# EasyEDA Pro project ProPrj_IoT House_2026-04-28.epro, board PCB2
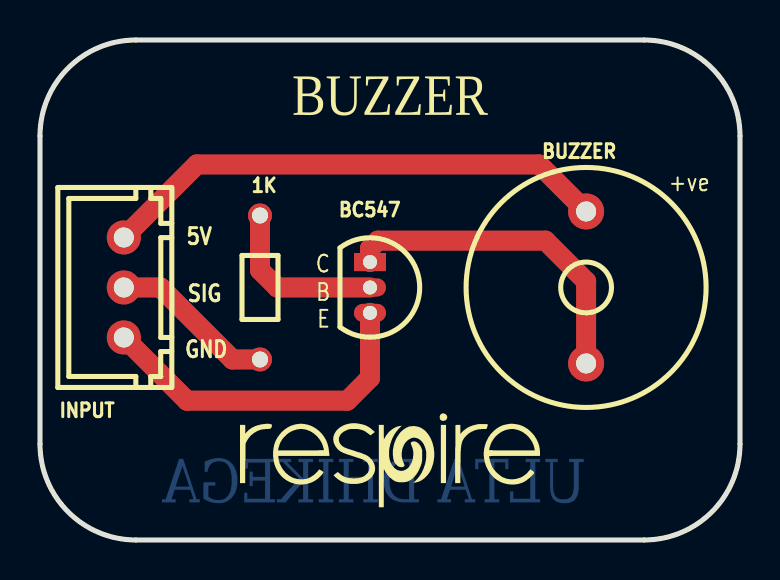
[diagram p7: board, top side]
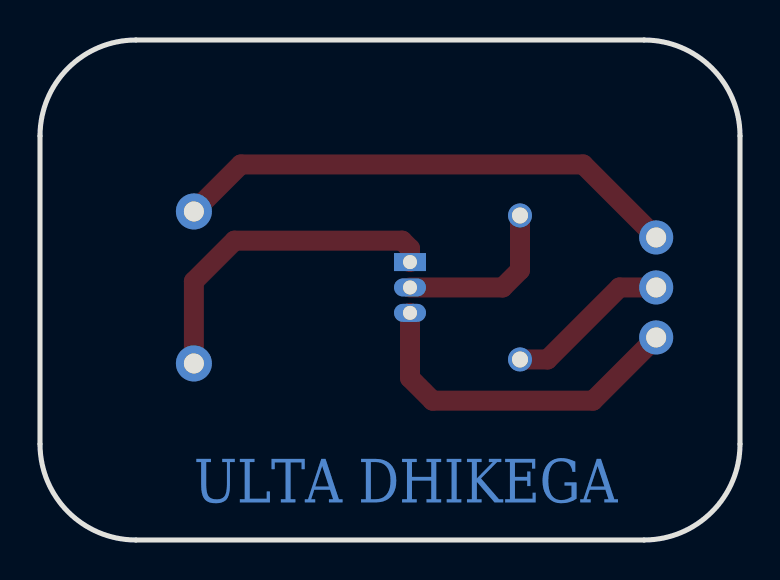
[diagram p8: board, bottom side, seen from below]

Outline 35 x 25 mm; copper layers: Top Layer, Bottom Layer. Coordinates in mm from the lower left corner of the outline.
Outline path: 0,20.2 0,4.8 arc(1.41,1.41) 4.8,0 30.2,0 arc(33.59,1.41) 35,4.8 35,20.2 arc(33.59,23.59) 30.2,25 4.8,25 arc(1.41,23.59) 0,20.2
Stack: Top Layer 0.035mm / Dielectric1 1.51mm FR4 er 4.5 / Bottom Layer 0.035mm

## Design rules (mm)
template: JLCPCB Capability(Two Layers Board)
spacing copperThickness1oz (default): track to track 0.102, other pairs 0.152 to 0.3
spacing copperThickness2oz: track to track 0.203, other pairs 0.152 to 0.3
track width copperThickness1oz (default): min 0.127, default 0.254, max 2.54
track width copperThickness2oz: min 0.203, default 0.254, max 2.54
differential pair differentialPair (default): width min 0.127, default 0.254, max 2.54; gap min 0.152, default 0.152
via viaSize (default): diameter min 0.5, default 0.61, max 10; hole min 0.3, default 0.305, max 6.3

## Placement (name value [footprint] x y rotation side)
1K  100  [RES-TH_BD1.8-L3.2-P7.20-D0.4]  11 12.63 90 top
BC547  BC547  [TO-92-3_L4.9-W3.7-P1.27-L]  16.5 12.63 270 top
BUZZER  2.4kHz  [BUZ-TH_BD12.0-P7.60-D0.6-FD]  27.31 12.63 270 top
INPUT  XH-3PA  [CONN-TH_3P-P2.50_ZHOURI_XH-3PA]  4.19 12.63 270 top

## Footprints (pads in the part's own frame, mm; a bottom-side part is the same pattern mirrored in y, then rotated)
BUZ-TH_BD12.0-P7.60-D0.6-FD
  round 1.8 hole 1: 1(-3.8,0) 2(3.8,0)
CONN-TH_3P-P2.50_ZHOURI_XH-3PA
  round 1.7 hole 1: 1(-2.5,0) 2(0,0) 3(2.5,0)
RES-TH_BD1.8-L3.2-P7.20-D0.4
  round 1.2 hole 0.8: 1(-3.6,0) 2(3.6,0)
TO-92-3_L4.9-W3.7-P1.27-L
  rect 0.9x1.6 hole 0.7: 1(-1.27,0)
  oval 0.9x1.6 hole 0.7: 2(0,0) 3(1.27,0)

## Nets
$1N647: BC547.1 BUZZER.2
$1N998: 1K.1 INPUT.2
$1N1001: 1K.2 BC547.2
$1N1034: BUZZER.1 INPUT.1
$1N1040: BC547.3 INPUT.3

## Routing (per net, layer and track width the routed paths; a pad name or vN(x,y) marks a point on that pad's centre or on a via; arc(x,y) is an arc through that point)
$1N647: length 16.6
  Top Layer w1: BUZZER.2 27.31,12.94 25.27,14.97 16.89,14.97 16.5,14.58 BC547.1
$1N998: length 8.3
  Top Layer w1: 1K.1 9.62,9.03 6.02,12.63 INPUT.2
$1N1001: length 8.6
  Top Layer w1: BC547.2 11.87,12.63 11,13.49 1K.2
$1N1034: length 25.6
  Top Layer w1: INPUT.1 7.84,18.78 24.96,18.78 BUZZER.1
$1N1040: length 17.3
  Top Layer w1: BC547.3 16.5,8.1 15.37,6.97 7.35,6.97 INPUT.3

## Text on the board
Bottom Layer: ULTA DHIKEGA
Top Silkscreen Layer: GND | 5V | SIG | C | B | E | +ve | BUZZER
